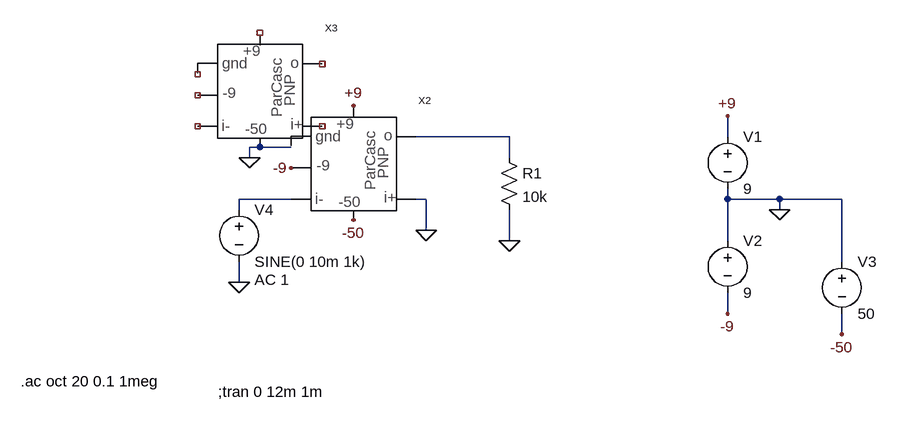
[diagram p0: schematic par-cascode-pnp.asc]
par-cascode-pnp.asc, the LTspice schematic file:
Version 4
SHEET 1 940 680
WIRE 368 96 224 96
WIRE 704 96 704 64
WIRE 32 112 -32 112
WIRE -32 128 -32 112
WIRE 368 128 368 96
WIRE 32 192 -48 192
WIRE 240 192 224 192
WIRE 704 192 704 176
WIRE 784 192 704 192
WIRE 880 192 784 192
WIRE -48 208 -48 192
WIRE 784 208 784 192
WIRE 240 240 240 192
WIRE 368 256 368 208
WIRE 704 256 704 192
WIRE 880 288 880 192
WIRE -48 320 -48 288
WIRE 704 368 704 336
WIRE 880 400 880 368
FLAG 784 208 0
FLAG 704 64 +9
FLAG 704 368 -9
FLAG 880 400 -50
FLAG 128 48 +9
FLAG 32 144 -9
FLAG 128 224 -50
FLAG 240 240 0
FLAG -48 320 0
FLAG -32 128 0
FLAG 368 256 0
SYMBOL rui\\shortcuts\\voltage 704 80 R0
WINDOW 123 0 0 Left 2
WINDOW 39 0 0 Left 2
SYMATTR InstName V1
SYMATTR Value 9
SYMBOL rui\\shortcuts\\voltage 704 240 R0
WINDOW 123 0 0 Left 2
WINDOW 39 0 0 Left 2
SYMATTR InstName V2
SYMATTR Value 9
SYMBOL rui\\shortcuts\\voltage 880 272 R0
WINDOW 123 0 0 Left 2
WINDOW 39 0 0 Left 2
SYMATTR InstName V3
SYMATTR Value 50
SYMBOL rui\\shortcuts\\voltage -48 192 R0
WINDOW 123 24 124 Left 2
WINDOW 39 0 0 Left 2
SYMATTR Value2 AC 1
SYMATTR InstName V4
SYMATTR Value SINE(0 10m 1k)
SYMBOL res 352 112 R0
SYMATTR InstName R1
SYMATTR Value 10k
SYMBOL ss-par-cascode-pnp 128 128 R0
SYMATTR InstName X2
SYMBOL ss-par-cascode-pnp -16 16 R0
SYMATTR InstName X3
TEXT -80 488 Left 2 !;tran 0 12m 1m
TEXT -384 472 Left 2 !.ac oct 20 0.1 1meg

The netlist it stands for:
* par-cascode-pnp.asc
V1 +9 0 9
V2 0 -9 9
V3 0 -50 50
V4 N002 0 SINE(0 10m 1k) AC 1
R1 N001 0 10k
XX2 N002 0 N001 +9 -50 0 -9 ss-par-cascode-pnp  ; pins i- i+ o +9 -50 grnd -9
XX3 NC_01 NC_02 NC_03 NC_04 0 NC_05 NC_06 ss-par-cascode-pnp  ; pins i- i+ o +9 -50 grnd -9
;tran 0 12m 1m
.ac oct 20 0.1 1meg
.backanno
.end